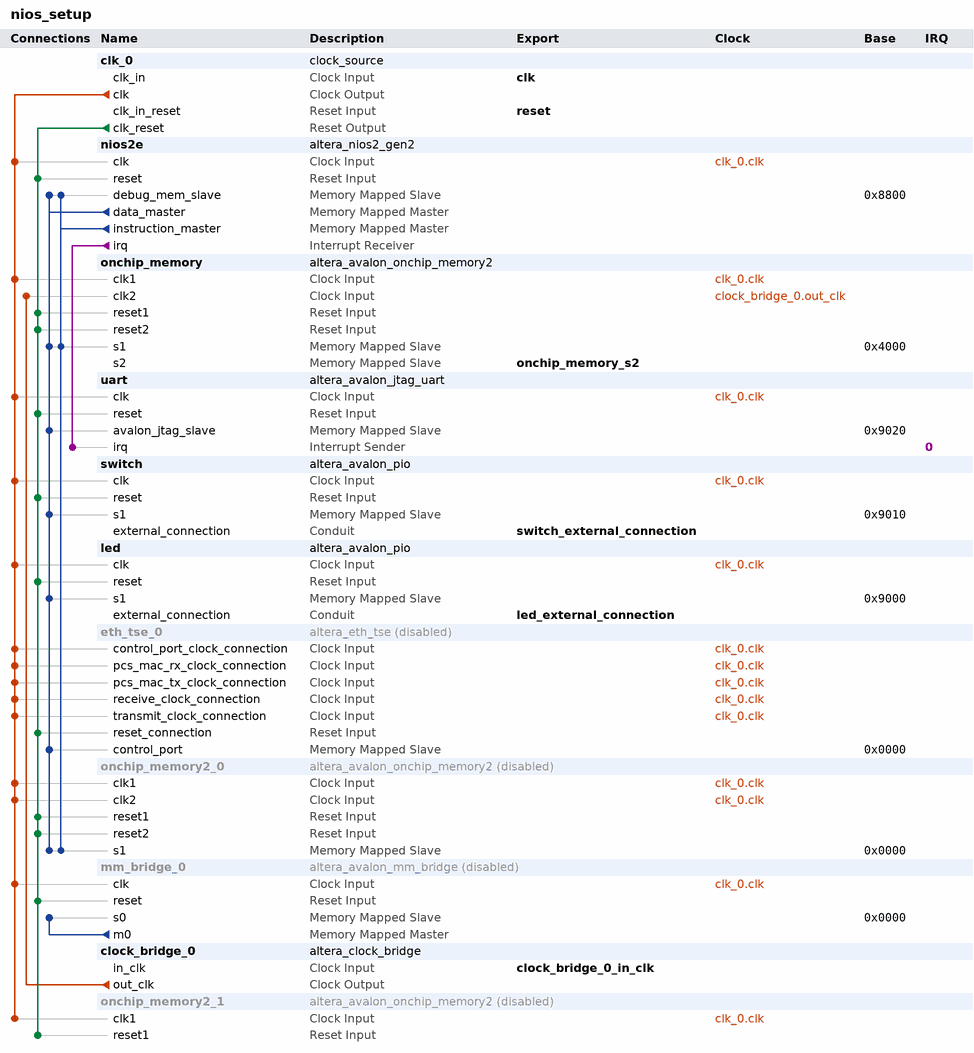
[diagram p0: system contents]
# Platform Designer (Qsys) system nios_setup, MAX 10 10M50DAF484C6GES
# Parameters at their usual value, and those the tool derives, are not listed.
package require -exact qsys 23.1
create_system nios_setup
set_project_property DEVICE_FAMILY {MAX 10}
set_project_property DEVICE 10M50DAF484C6GES

add_instance clk_0 clock_source 23.1
set_instance_parameter_value clk_0 clockFrequency 50000000

add_instance nios2e altera_nios2_gen2 23.1
set_instance_parameter_value nios2e dcache_size 2048
set_instance_parameter_value nios2e exceptionSlave onchip_memory.s1
set_instance_parameter_value nios2e icache_size 4096
set_instance_parameter_value nios2e impl Tiny
set_instance_parameter_value nios2e resetSlave onchip_memory.s1

add_instance onchip_memory altera_avalon_onchip_memory2 23.1
set_instance_parameter_value onchip_memory dataWidth 32
set_instance_parameter_value onchip_memory dualPort true
set_instance_parameter_value onchip_memory initMemContent false
set_instance_parameter_value onchip_memory initializationFileName onchip_mem.hex
set_instance_parameter_value onchip_memory memorySize 16384

add_instance uart altera_avalon_jtag_uart 23.1
set_instance_parameter_value uart simInteractiveOptions NO_INTERACTIVE_WINDOWS

add_instance switch altera_avalon_pio 23.1
set_instance_parameter_value switch direction Input
set_instance_parameter_value switch width 8

add_instance led altera_avalon_pio 23.1
set_instance_parameter_value led direction Output
set_instance_parameter_value led width 8

add_instance eth_tse_0 altera_eth_tse 23.1
set_instance_property eth_tse_0 ENABLED false
set_instance_parameter_value eth_tse_0 XCVR_RCFG_JTAG_ENABLE 0
set_instance_parameter_value eth_tse_0 XCVR_SET_CAPABILITY_REG_ENABLE 0
set_instance_parameter_value eth_tse_0 XCVR_SET_CSR_SOFT_LOGIC_ENABLE 0
set_instance_parameter_value eth_tse_0 XCVR_SET_PRBS_SOFT_LOGIC_ENABLE 0
set_instance_parameter_value eth_tse_0 XCVR_SET_USER_IDENTIFIER 0
set_instance_parameter_value eth_tse_0 core_variation MAC_ONLY
set_instance_parameter_value eth_tse_0 enable_gmii_loopback true
set_instance_parameter_value eth_tse_0 enable_hd_logic true
set_instance_parameter_value eth_tse_0 enable_mac_flow_ctrl false
set_instance_parameter_value eth_tse_0 enable_magic_detect true
set_instance_parameter_value eth_tse_0 enable_shift16 true
set_instance_parameter_value eth_tse_0 ext_stat_cnt_ena true
set_instance_parameter_value eth_tse_0 ifGMII MII_GMII
set_instance_parameter_value eth_tse_0 ing_addr 11
set_instance_parameter_value eth_tse_0 mdio_clk_div 40
set_instance_parameter_value eth_tse_0 stat_cnt_ena true
set_instance_parameter_value eth_tse_0 transceiver_type NONE
set_instance_parameter_value eth_tse_0 useMDIO false

add_instance onchip_memory2_0 altera_avalon_onchip_memory2 23.1
set_instance_property onchip_memory2_0 ENABLED false
set_instance_parameter_value onchip_memory2_0 dataWidth 32
set_instance_parameter_value onchip_memory2_0 dualPort true
set_instance_parameter_value onchip_memory2_0 initMemContent false
set_instance_parameter_value onchip_memory2_0 initializationFileName onchip_mem.hex
set_instance_parameter_value onchip_memory2_0 memorySize 1024

add_instance mm_bridge_0 altera_avalon_mm_bridge 23.1
set_instance_property mm_bridge_0 ENABLED false
set_instance_parameter_value mm_bridge_0 ADDRESS_UNITS SYMBOLS
set_instance_parameter_value mm_bridge_0 ADDRESS_WIDTH 10
set_instance_parameter_value mm_bridge_0 DATA_WIDTH 32
set_instance_parameter_value mm_bridge_0 MAX_PENDING_RESPONSES 4
set_instance_parameter_value mm_bridge_0 USE_AUTO_ADDRESS_WIDTH 0

add_instance clock_bridge_0 altera_clock_bridge 23.1
set_instance_parameter_value clock_bridge_0 DERIVED_CLOCK_RATE 0
set_instance_parameter_value clock_bridge_0 EXPLICIT_CLOCK_RATE 0

add_instance onchip_memory2_1 altera_avalon_onchip_memory2 23.1
set_instance_property onchip_memory2_1 ENABLED false
set_instance_parameter_value onchip_memory2_1 allowInSystemMemoryContentEditor true
set_instance_parameter_value onchip_memory2_1 dataWidth 32
set_instance_parameter_value onchip_memory2_1 dualPort false
set_instance_parameter_value onchip_memory2_1 initMemContent false
set_instance_parameter_value onchip_memory2_1 initializationFileName onchip_mem.hex
set_instance_parameter_value onchip_memory2_1 memorySize 128

# connections
add_connection clk_0.clk eth_tse_0.control_port_clock_connection clock
add_connection clk_0.clk eth_tse_0.pcs_mac_rx_clock_connection clock
add_connection clk_0.clk eth_tse_0.pcs_mac_tx_clock_connection clock
add_connection clk_0.clk eth_tse_0.receive_clock_connection clock
add_connection clk_0.clk eth_tse_0.transmit_clock_connection clock
add_connection clk_0.clk led.clk clock
add_connection clk_0.clk mm_bridge_0.clk clock
add_connection clk_0.clk nios2e.clk clock
add_connection clk_0.clk onchip_memory2_0.clk1 clock
add_connection clk_0.clk onchip_memory2_0.clk2 clock
add_connection clk_0.clk onchip_memory2_1.clk1 clock
add_connection clk_0.clk onchip_memory.clk1 clock
add_connection clk_0.clk switch.clk clock
add_connection clk_0.clk uart.clk clock
add_connection clock_bridge_0.out_clk onchip_memory.clk2 clock
add_connection clk_0.clk_reset eth_tse_0.reset_connection reset
add_connection clk_0.clk_reset led.reset reset
add_connection clk_0.clk_reset mm_bridge_0.reset reset
add_connection clk_0.clk_reset nios2e.reset reset
add_connection clk_0.clk_reset onchip_memory2_0.reset1 reset
add_connection clk_0.clk_reset onchip_memory2_0.reset2 reset
add_connection clk_0.clk_reset onchip_memory2_1.reset1 reset
add_connection clk_0.clk_reset onchip_memory.reset1 reset
add_connection clk_0.clk_reset onchip_memory.reset2 reset
add_connection clk_0.clk_reset switch.reset reset
add_connection clk_0.clk_reset uart.reset reset
add_connection mm_bridge_0.m0 mm_bridge_0.s0 avalon
set_connection_parameter_value mm_bridge_0.m0/mm_bridge_0.s0 baseAddress 0x0000
add_connection nios2e.data_master eth_tse_0.control_port avalon
set_connection_parameter_value nios2e.data_master/eth_tse_0.control_port baseAddress 0x0000
add_connection nios2e.data_master led.s1 avalon
set_connection_parameter_value nios2e.data_master/led.s1 baseAddress 0x9000
add_connection nios2e.data_master nios2e.debug_mem_slave avalon
set_connection_parameter_value nios2e.data_master/nios2e.debug_mem_slave baseAddress 0x8800
add_connection nios2e.data_master onchip_memory2_0.s1 avalon
set_connection_parameter_value nios2e.data_master/onchip_memory2_0.s1 baseAddress 0x0000
add_connection nios2e.data_master onchip_memory.s1 avalon
set_connection_parameter_value nios2e.data_master/onchip_memory.s1 baseAddress 0x4000
add_connection nios2e.data_master switch.s1 avalon
set_connection_parameter_value nios2e.data_master/switch.s1 baseAddress 0x9010
add_connection nios2e.data_master uart.avalon_jtag_slave avalon
set_connection_parameter_value nios2e.data_master/uart.avalon_jtag_slave baseAddress 0x9020
add_connection nios2e.instruction_master nios2e.debug_mem_slave avalon
set_connection_parameter_value nios2e.instruction_master/nios2e.debug_mem_slave baseAddress 0x8800
add_connection nios2e.instruction_master onchip_memory2_0.s1 avalon
set_connection_parameter_value nios2e.instruction_master/onchip_memory2_0.s1 baseAddress 0x0000
add_connection nios2e.instruction_master onchip_memory.s1 avalon
set_connection_parameter_value nios2e.instruction_master/onchip_memory.s1 baseAddress 0x4000
add_connection nios2e.irq uart.irq interrupt
set_connection_parameter_value nios2e.irq/uart.irq irqNumber 0

# exported interfaces
add_interface clk clock sink
set_interface_property clk EXPORT_OF clk_0.clk_in
add_interface clock_bridge_0_in_clk clock sink
set_interface_property clock_bridge_0_in_clk EXPORT_OF clock_bridge_0.in_clk
add_interface led_external_connection conduit end
set_interface_property led_external_connection EXPORT_OF led.external_connection
add_interface onchip_memory_s2 avalon slave
set_interface_property onchip_memory_s2 EXPORT_OF onchip_memory.s2
add_interface reset reset sink
set_interface_property reset EXPORT_OF clk_0.clk_in_reset
add_interface switch_external_connection conduit end
set_interface_property switch_external_connection EXPORT_OF switch.external_connection

set_interconnect_requirement {$system} qsys_mm.clockCrossingAdapter HANDSHAKE
set_interconnect_requirement {$system} qsys_mm.enableEccProtection FALSE
set_interconnect_requirement {$system} qsys_mm.insertDefaultSlave FALSE
set_interconnect_requirement {$system} qsys_mm.maxAdditionalLatency 1

save_system nios_setup.qsys
